# Altium schematic sheet SX126x.SchDoc: SX126x
size A4; Author: Lucas Liaño; Revision: 1; SheetNumber: 5; SheetTotal: 8
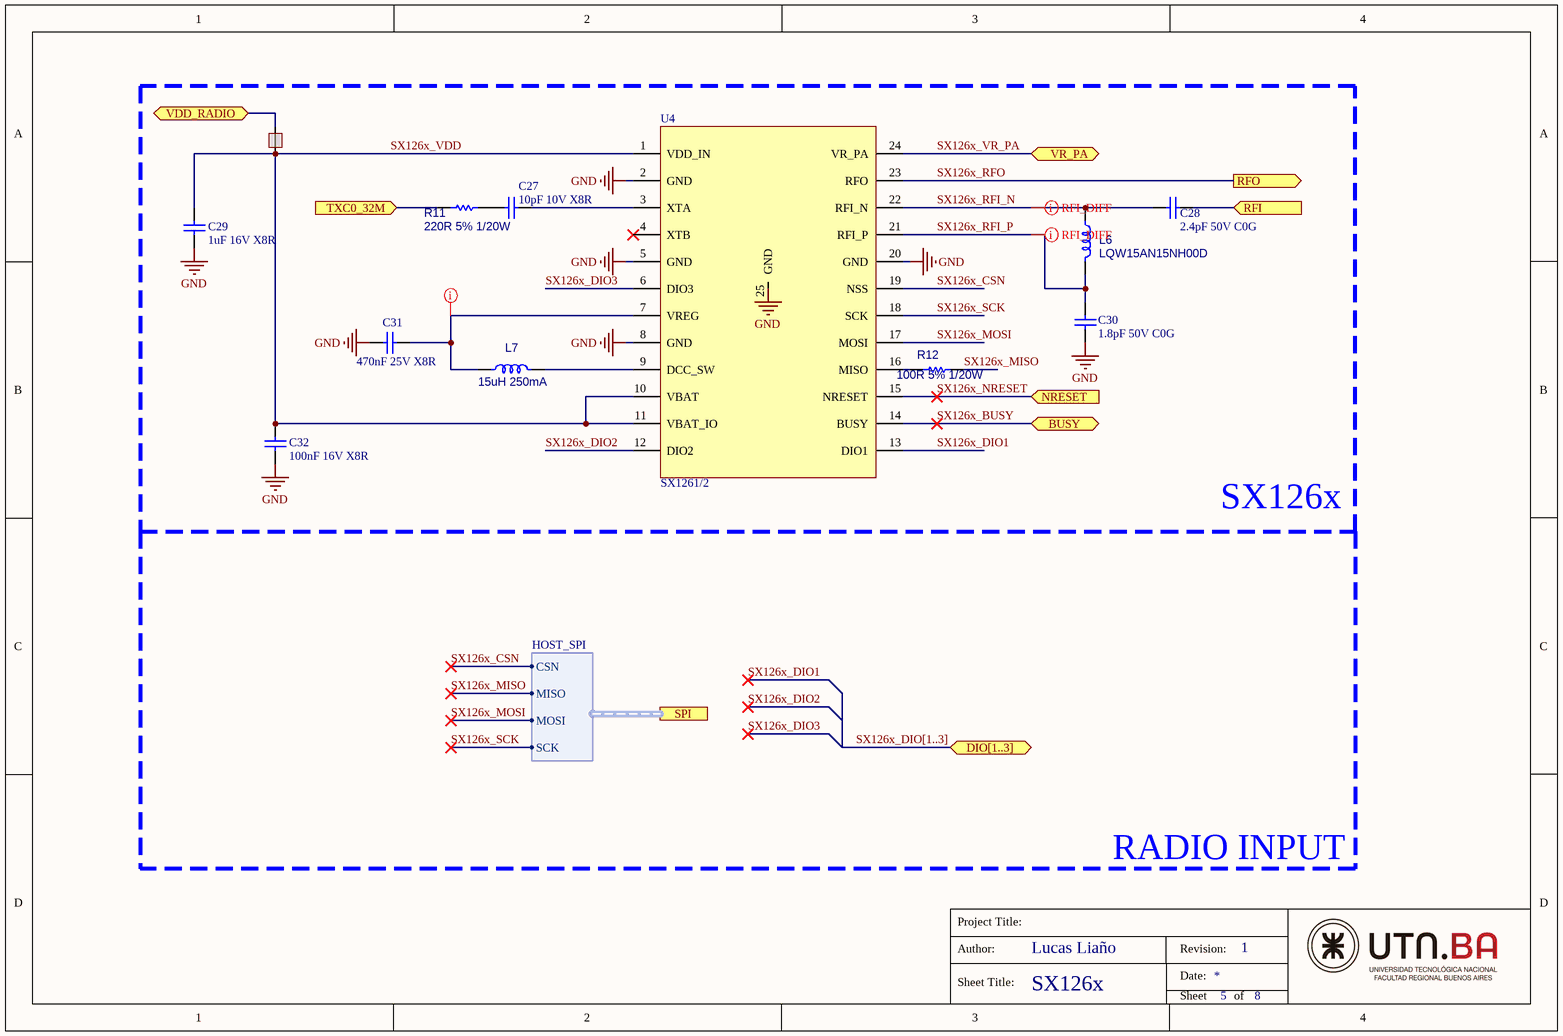
[diagram p0: SX126x.SchDoc]

## Parts
C27  10pF 10V X8R  [C_0603]
C28  2.4pF 50V C0G  [C_0603]
C29  1uF 16V X8R  [C_0603]
C30  1.8pF 50V C0G  [C_0603]
C31  470nF 25V X8R  [C_0603]
C32  100nF 16V X8R  [C_0603]
L6  LQW15AN15NH00D  [L_0402]
L7  15uH 250mA  [0805[2012]]
NT17  NT  [NTIE24]  (value not drawn)  (net tie, no BOM)
R11  220R 5% 1/20W  [0603[1608]]
R12  100R 5% 1/20W  [0603[1608]]
U4  SX1261/2  [vqfn24_4x4mm]

## Blocks framed on the sheet
SX126x: C27-C32 L6 L7 NT17 R11 R12 U4

## Ports
BUSY (bidir), DIO[1..3] (bidir), NRESET (in), RFI (in), RFO (out), SPI (harness HOST_SPI), TXC0_32M (in), VDD_RADIO (bidir), VR_PA (bidir)

## Harnesses
HOST_SPI: CSN, MISO, MOSI, SCK

## Nets
GND: C29.2 C30.2 C31.2 C32.2 U4.2(GND) U4.5(GND) U4.8(GND) U4.20(GND) U4.25(GND)
RFI: C28.2 ; port RFI
SX126x_BUSY: U4.14(BUSY) ; port BUSY
SX126x_CSN: U4.19(NSS) ; port SPI.CSN
SX126x_DIO1: U4.13(DIO1)
SX126x_DIO2: U4.12(DIO2)
SX126x_DIO3: U4.6(DIO3)
SX126x_MISO: R12.1 ; port SPI.MISO
SX126x_MOSI: U4.17(MOSI) ; port SPI.MOSI
SX126x_NRESET: U4.15(NRESET) ; port NRESET
SX126x_RFI_N: C28.1 L6.1 U4.22(RFI_N)
SX126x_RFI_P: C30.1 L6.2 U4.21(RFI_P)
SX126x_RFO: U4.23(RFO) ; port RFO
SX126x_SCK: U4.18(SCK) ; port SPI.SCK
SX126x_VDD: C29.1 C32.1 NT17.1 U4.1(VDD_IN) U4.10(VBAT) U4.11(VBAT_IO)
SX126x_VR_PA: U4.24(VR_PA) ; port VR_PA
TXC0_32M: R11.1 ; port TXC0_32M
VDD_RADIO: NT17.2 ; port VDD_RADIO
NetC27_1: C27.1 U4.3(XTA)
NetC27_2: C27.2 R11.2
NetC31_1: C31.1 L7.1 U4.7(VREG)
NetL7_2: L7.2 U4.9(DCC_SW)
NetR12_2: R12.2 U4.16(MISO)

Not connected (* = marked no-connect by the designer): U4 4(XTB)*

## Buses and harness runs
bus SX126x_DIO[1..3] = port DIO[1..3]

## Layout directives
differential pair; differential pair class RFI_DIFF: SX126x_RFI_N, SX126x_RFI_P
rule Polygon Connect Style [Style - Direct Connect]; net class DirectConnectPolygon: NetC31_1

## Notes on the sheet
- Project Title:
- RADIO INPUT
- Author:
- Sheet Title:
- Date:
- Revision:
- Sheet
- of

## Library data of the parts
C27 = Cap: Capacitor; MPN: C0603X100J8HACAUTO; Manufacturer: KEMET; Package: 0603; Price (USD): 0.1; ComponentLink2Description: SupplierLink; ComponentLink1Description: Datasheet; ComponentLink2URL: *; ComponentLink1URL: *; Value: 10pF 10V X8R; Supplier: Digikey
C28 = Cap: Capacitor; MPN: GJM0335C1H2R4WB01; Manufacturer: Murata Electronics; Package: 0603; Price (USD): 0.2; ComponentLink2Description: SupplierLink; ComponentLink1Description: Datasheet; ComponentLink2URL: https://www.digikey.com/es/products/detail/murata-electronics/GJM0335C1H2R4WB01D/11618768?s=N4IgTCBcDaIOICkCyAGAzGgrAYQIwAkwAlAFgHUAhFXEAXQF8g; ComponentLink1URL: https://www.digikey.com/es/products/detail/murata-electronics/GJM0335C1H2R4WB01D/11618768?s=N4IgTCBcDaIOICkCyAGAzGgrAYQIwAkwAlAFgHUAhFXEAXQF8g; Value: 2.4pF 50V C0G; Supplier: Digikey
C29 = Cap: Capacitor; MPN: CGA4J3X8R1C105K125AB; Manufacturer: TDK Corporation; Package: 0603; Price (USD): 0.4; ComponentLink2Description: SupplierLink; ComponentLink1Description: Datasheet; ComponentLink2URL: *; ComponentLink1URL: *; Value: 1uF 16V X8R; Supplier: Digikey
C30 = Cap: Capacitor; MPN: GJM0335C1H1R8WB01; Manufacturer: Murata Electronics; Package: 0603; Price (USD): 0.2; ComponentLink2Description: SupplierLink; ComponentLink1Description: Datasheet; ComponentLink2URL: https://www.digikey.com/es/products/detail/murata-electronics/GJM0335C1H1R8WB01D/11618749?s=N4IgTCBcDaIOICkCyAGAzGgrAYQIwAlcAlADgHUAhFXEAXQF8g; ComponentLink1URL: https://www.digikey.com/es/products/detail/murata-electronics/GJM0335C1H1R8WB01D/11618749?s=N4IgTCBcDaIOICkCyAGAzGgrAYQIwAlcAlADgHUAhFXEAXQF8g; Value: 1.8pF 50V C0G; Supplier: Digikey
C31 = Cap: Capacitor; MPN: VJ0603H472JXXAC; Manufacturer: Vishay; Package: 0603; Price (USD): 0.2; ComponentLink2Description: SupplierLink; ComponentLink1Description: Datasheet; ComponentLink2URL: *; ComponentLink1URL: *; Value: 470nF 25V X8R; Supplier: Digikey
C32 = Cap: Capacitor; MPN: C1206C104K4HACAUTO; Manufacturer: KEMET; Package: 0603; Price (USD): 0.3; ComponentLink2Description: SupplierLink; ComponentLink1Description: Datasheet; ComponentLink2URL: *; ComponentLink1URL: *; Value: 100nF 16V X8R; Supplier: Digikey
L6 = IND: Inductor; Manufacturer: *; MPN: LQW15AN15NH00D; Package: *; Price (USD): *; Value: *; ComponentLink1Description: Datasheet; ComponentLink1URL: *; ComponentLink2Description: SupplierLink; ComponentLink2URL: *
L7 = IND: FIXED IND 15UH 250MA 950MOHM SMD; Manufacturer: TDK Corporation; MPN: MLZ2012M150WT000; Package: 0805; Price (USD): 0.13; Value: 15uH 250mA; ComponentLink1Description: Datasheet; ComponentLink1URL: N/C; ComponentLink2Description: SupplierLink; ComponentLink2URL: https://www.digikey.com/en/products/detail/tdk-corporation/MLZ2012M150WT000/2465154; Supplier: Digikey
NT17 = NTIE: NET_TIE; ComponentLink1Description: Datasheet; ComponentLink2Description: SupplierLink
R11 = Res: Resistor; Manufacturer: Panasonic Electronic Components; MPN: ERJ-1GNJ221C; Package: 0603; Price (USD): 0.1; Value: 220R 5% 1/20W; ComponentLink1Description: Datasheet; ComponentLink1URL: *; ComponentLink2Description: SupplierLink; ComponentLink2URL: *; Supplier: Digikey
R12 = Res: Resistor; Manufacturer: Stackpole; MPN: RMCF0201JT100R; Package: 0603; Price (USD): 0.1; Value: 100R 5% 1/20W; ComponentLink1Description: Datasheet; ComponentLink1URL: https://www.digikey.com/es/products/detail/stackpole-electronics-inc/RMCF0201JT100R/3906031; ComponentLink2Description: SupplierLink; ComponentLink2URL: https://www.digikey.com/es/products/detail/stackpole-electronics-inc/RMCF0201JT100R/3906031; Supplier: Digikey
U4 = SX126x: SX1261/2 - Ultra low power RF transceiver; Manufacturer: Semtech; MPN: SX1261IMLTRT; Value: IC RF TXRX ISM<1GHZ 24VFQFN; ComponentLink1Description: Datasheet; ComponentLink1URL: https://semtech.my.salesforce.com/sfc/p/E0000000JelG/a/2R000000HT7B/4cQ1B3JG0iKRo9DGRkjVuxclfwB.3tfSUcGr.S_dPd4; ComponentLink2Description: SupplierLink; ComponentLink2URL: https://www.digikey.com/en/products/detail/semtech-corporation/SX1261IMLTRT/8564368?s=N4IgTCBcDaIM4A8CMYBsSQF0C%2BQ; Package: 24-VFQFN; Price (USD): 8; Supplier: Digikey